# EAGLE schematic Ela (EAGLE 9.6.2)
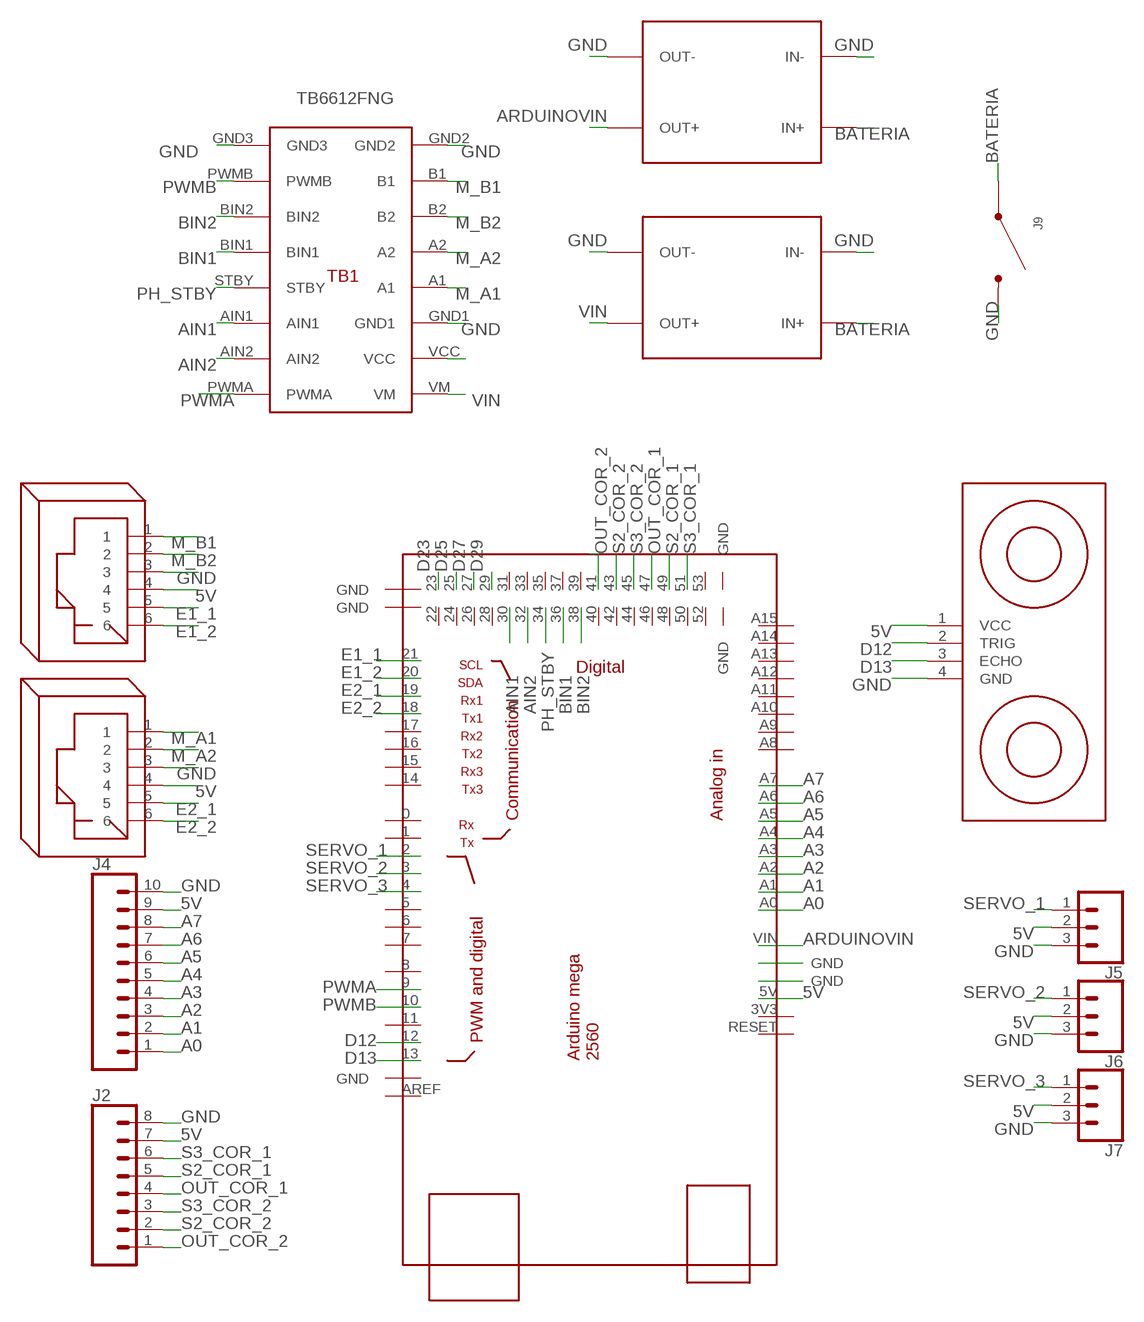
[diagram p0: schematic, sheet 1]

## Parts
J1  RJ12  [RJ12]
J2  CONN_08LONGPADS  [1X08_LONGPADS]
J3  RJ12  [RJ12]
J4  CONN_10"  [1X10]
J5  CONN_03LONGPADS  [1X03_LONGPADS]
J6  CONN_03LONGPADS  [1X03_LONGPADS]
J7  CONN_03LONGPADS  [1X03_LONGPADS]
J9  XT60TOP  [XT60_TOP]
TB1  TB6612FNG  [TB6612FNG]
U$1  ULTRASONIC-HC-SR04#V  [ULTRASONIC-HC-SR04#V]
U$2  DC-DC-STEP-DOWN-LM2596  [DC-DC-STEP-DOWN-LM2596]
U$3  MEGA_DEVICE  [MEGAOUTLINE]
U$4  DC-DC-STEP-DOWN-LM2596  [DC-DC-STEP-DOWN-LM2596]

## Nets
5V: J1.4 J2.7 J3.4 J4.9 J5.2 J6.2 J7.2 TB1.VCC U$1.1(VCC) U$3.5V
A0: J4.1 U$3.A0
A1: J4.2 U$3.A1
A2: J4.3 U$3.A2
A3: J4.4 U$3.A3
A4: J4.5 U$3.A4
A5: J4.6 U$3.A5
A6: J4.7 U$3.A6
A7: J4.8 U$3.A7
AIN1: TB1.AIN1 U$3.30
AIN2: TB1.AIN2 U$3.32
ARDUINOVIN: U$3.VIN U$4.OUT+
BATERIA: J9.P$+(+) U$2.IN+ U$4.IN+
BIN1: TB1.BIN1 U$3.36
BIN2: TB1.BIN2 U$3.38
D12: U$1.2(TRIG) U$3.12
D13: U$1.3(ECHO) U$3.13
D23: U$3.23
D25: U$3.25
D27: U$3.27
D29: U$3.29
E1_1: J1.5 U$3.21
E1_2: J1.6 U$3.20
E2_1: J3.5 U$3.19
E2_2: J3.6 U$3.18
GND: J1.3 J2.8 J3.3 J4.10 J5.3 J6.3 J7.3 J9.P$-(-) TB1.GND1 TB1.GND2 TB1.GND3 U$1.4(GND) U$2.IN- U$2.OUT- U$4.IN- U$4.OUT-
M_A1: J3.1 TB1.A1
M_A2: J3.2 TB1.A2
M_B1: J1.1 TB1.B1
M_B2: J1.2 TB1.B2
N$10: U$3.GND@3(GND)
N$11: U$3.GND@2(GND)
OUT_COR_1: J2.4 U$3.47
OUT_COR_2: J2.1 U$3.41
PH_STBY: TB1.STBY U$3.34
PWMA: TB1.PWMA U$3.9
PWMB: TB1.PWMB U$3.10
S2_COR_1: J2.5 U$3.49
S2_COR_2: J2.2 U$3.43
S3_COR_1: J2.6 U$3.51
S3_COR_2: J2.3 U$3.45
SERVO_1: J5.1 U$3.2
SERVO_2: J6.1 U$3.3
SERVO_3: J7.1 U$3.4
VIN: TB1.VM U$2.OUT+
Unconnected: U$3.0 U$3.1 U$3.3V3 U$3.5 U$3.6 U$3.7 U$3.8 U$3.11 U$3.14 U$3.15 U$3.16 U$3.17 U$3.22 U$3.24 U$3.26 U$3.28 U$3.31 U$3.33 U$3.35 U$3.37 U$3.39 U$3.40 U$3.42 U$3.44 U$3.46 U$3.48 U$3.50 U$3.52 U$3.53 U$3.A8 U$3.A9 U$3.A10 U$3.A11 U$3.A12 U$3.A13 U$3.A14 U$3.A15 U$3.AREF U$3.GND@1(GND) U$3.GND@4(GND) U$3.GND@5(GND) U$3.GND@6(GND) U$3.GND@7(GND) U$3.RESET

## Library data of the parts
J1 J3 = con-rj:RJ12: RJ12, RJ14 and RJ25 RJ12, RJ14 and RJ25 jacks side mounted http://www.tycoelectronics.com
J2 = SparkFun-Connectors:CONN_08: Multi connection point. Often used as Generic Header-pin footprint for 0.1 inch spaced/style header connections On any of the 0.1 inch spaced packages, you can populate with these: Break Away Headers - Straight <https://www.sparkfun.com/products/116> (PRT-00116) Break Away Male Headers - Right Angle <https://www.sparkfun.com/products/553> (PRT-00553) Female Headers <https://www.sparkfun.com/products/115> (PRT-00115) Break Away Headers - Machine Pin <https://www.sparkfun.com/products/117> (PRT-00117) Break Away Female Headers - Swiss Machine Pin <https://www.sparkfun.com/products/743> (PRT-00743) Arduino Stackable Header - 8 Pin <https://www.sparkfun.com/products/9279> (PRT-09279) For SCREWTERMINALS and SPRING TERMINALS visit here: Screw Terimnals on SparkFun.com <https://www.sparkfun.com/search/results?term=Screw+Terminals> (5mm/3.5mm/2.54mm spacing) This device is also useful as a general connection point to wire up your design to another part of your project. Our various solder wires solder well into these plated through hole pads. Hook-Up Wire - Assortment (Stranded, 22 AWG) <https://www.sparkfun.com/products/11375> (PRT-11375) Hook-Up Wire - Assortment (Solid Core, 22 AWG) <https://www.sparkfun.com/products/11367> (PRT-11367) View the entire wire category on our website here <https://www.sparkfun.com/categories/141> Special notes: Molex polarized connector foot print use with SKU : PRT-08231 with associated crimp pins and housings. 1MM SMD Version SKU: PRT-10208 NOTES ON THE VARIANTS LOCK and LOCK_LONGPADS... This footprint was designed to help hold the alignment of a through-hole component (i.e. 6-pin header) while soldering it into place. You may notice that each hole has been shifted either up or down by 0.005 of an inch from it's more standard position (which is a perfectly straight line). This slight alteration caused the pins (the squares in the middle) to touch the edges of the holes. Because they are alternating, it causes a "brace" to hold the component in place. 0.005 has proven to be the perfect amount of "off-center" position when using our standard breakaway headers. Although looks a little odd when you look at the bare footprint, once you have a header in there, the alteration is very hard to notice. Also,if you push a header all the way into place, it is covered up entirely on the bottom side.
J4 = SparkFun-Connectors:CONN_10: Multi connection point. Often used as Generic Header-pin footprint for 0.1 inch spaced/style header connections On any of the 0.1 inch spaced packages, you can populate with these: Break Away Headers - Straight <https://www.sparkfun.com/products/116> (PRT-00116) Break Away Male Headers - Right Angle <https://www.sparkfun.com/products/553> (PRT-00553) Female Headers <https://www.sparkfun.com/products/115> (PRT-00115) Break Away Headers - Machine Pin <https://www.sparkfun.com/products/117> (PRT-00117) Break Away Female Headers - Swiss Machine Pin <https://www.sparkfun.com/products/743> (PRT-00743) Arduino Stackable Header - 10 Pin <https://www.sparkfun.com/products/11376> (PRT-11376) For SCREWTERMINALS and SPRING TERMINALS visit here: Screw Terimnals on SparkFun.com <https://www.sparkfun.com/search/results?term=Screw+Terminals> (5mm/3.5mm/2.54mm spacing) This device is also useful as a general connection point to wire up your design to another part of your project. Our various solder wires solder well into these plated through hole pads. Hook-Up Wire - Assortment (Stranded, 22 AWG) <https://www.sparkfun.com/products/11375> (PRT-11375) Hook-Up Wire - Assortment (Solid Core, 22 AWG) <https://www.sparkfun.com/products/11367> (PRT-11367) View the entire wire category on our website here <https://www.sparkfun.com/categories/141> Special notes: Molex polarized connector foot print use with SKU : PRT-08231 with associated crimp pins and housings. 1MM SMD Version SKU: PRT-10208 NOTES ON THE VARIANTS LOCK and LOCK_LONGPADS... This footprint was designed to help hold the alignment of a through-hole component (i.e. 6-pin header) while soldering it into place. You may notice that each hole has been shifted either up or down by 0.005 of an inch from it's more standard position (which is a perfectly straight line). This slight alteration caused the pins (the squares in the middle) to touch the edges of the holes. Because they are alternating, it causes a "brace" to hold the component in place. 0.005 has proven to be the perfect amount of "off-center" position when using our standard breakaway headers. Although looks a little odd when you look at the bare footprint, once you have a header in there, the alteration is very hard to notice. Also,if you push a header all the way into place, it is covered up entirely on the bottom side.; PROD_ID: CONN-11563
J5-J7 = SparkFun-Connectors:CONN_03: Multi connection point. Often used as Generic Header-pin footprint for 0.1 inch spaced/style header connections On any of the 0.1 inch spaced packages, you can populate with these: Break Away Headers - Straight <https://www.sparkfun.com/products/116> (PRT-00116) Break Away Male Headers - Right Angle <https://www.sparkfun.com/products/553> (PRT-00553) Female Headers <https://www.sparkfun.com/products/115> (PRT-00115) Break Away Headers - Machine Pin <https://www.sparkfun.com/products/117> (PRT-00117) Break Away Female Headers - Swiss Machine Pin <https://www.sparkfun.com/products/743> (PRT-00743) Stackable Header - 3 Pin (Female, 0.1") <https://www.sparkfun.com/products/13875> (PRT-13875) For SCREWTERMINALS and SPRING TERMINALS visit here: Screw Terimnals on SparkFun.com <https://www.sparkfun.com/search/results?term=Screw+Terminals> (5mm/3.5mm/2.54mm spacing) This device is also useful as a general connection point to wire up your design to another part of your project. Our various solder wires solder well into these plated through hole pads. Hook-Up Wire - Assortment (Stranded, 22 AWG) <https://www.sparkfun.com/products/11375> (PRT-11375) Hook-Up Wire - Assortment (Solid Core, 22 AWG) <https://www.sparkfun.com/products/11367> (PRT-11367) View the entire wire category on our website here <https://www.sparkfun.com/categories/141> Special notes: Molex polarized connector foot print use with SKU : PRT-08232 with associated crimp pins and housings.
J9 = Connectors:XT60: XT60 connector. Top view.
TB1 = TB6612FNG:TB6612FNG
U$1 = diy-modules:ULTRASONIC-HC-SR04: Ultrasonic Ranging Module HC-SR04
U$2 U$4 = diy-modules:DC-DC-STEP-DOWN-LM2596: DC/DC Step-Down Regulator based on LM2596-ADJ chip
U$3 = ArduinoMegaOutline:MEGA_DEVICE: mega card as device